# Altium schematic sheet MCU.SchDoc: MCU
size A4; Date: 2020/05/29; SheetNumber: 1
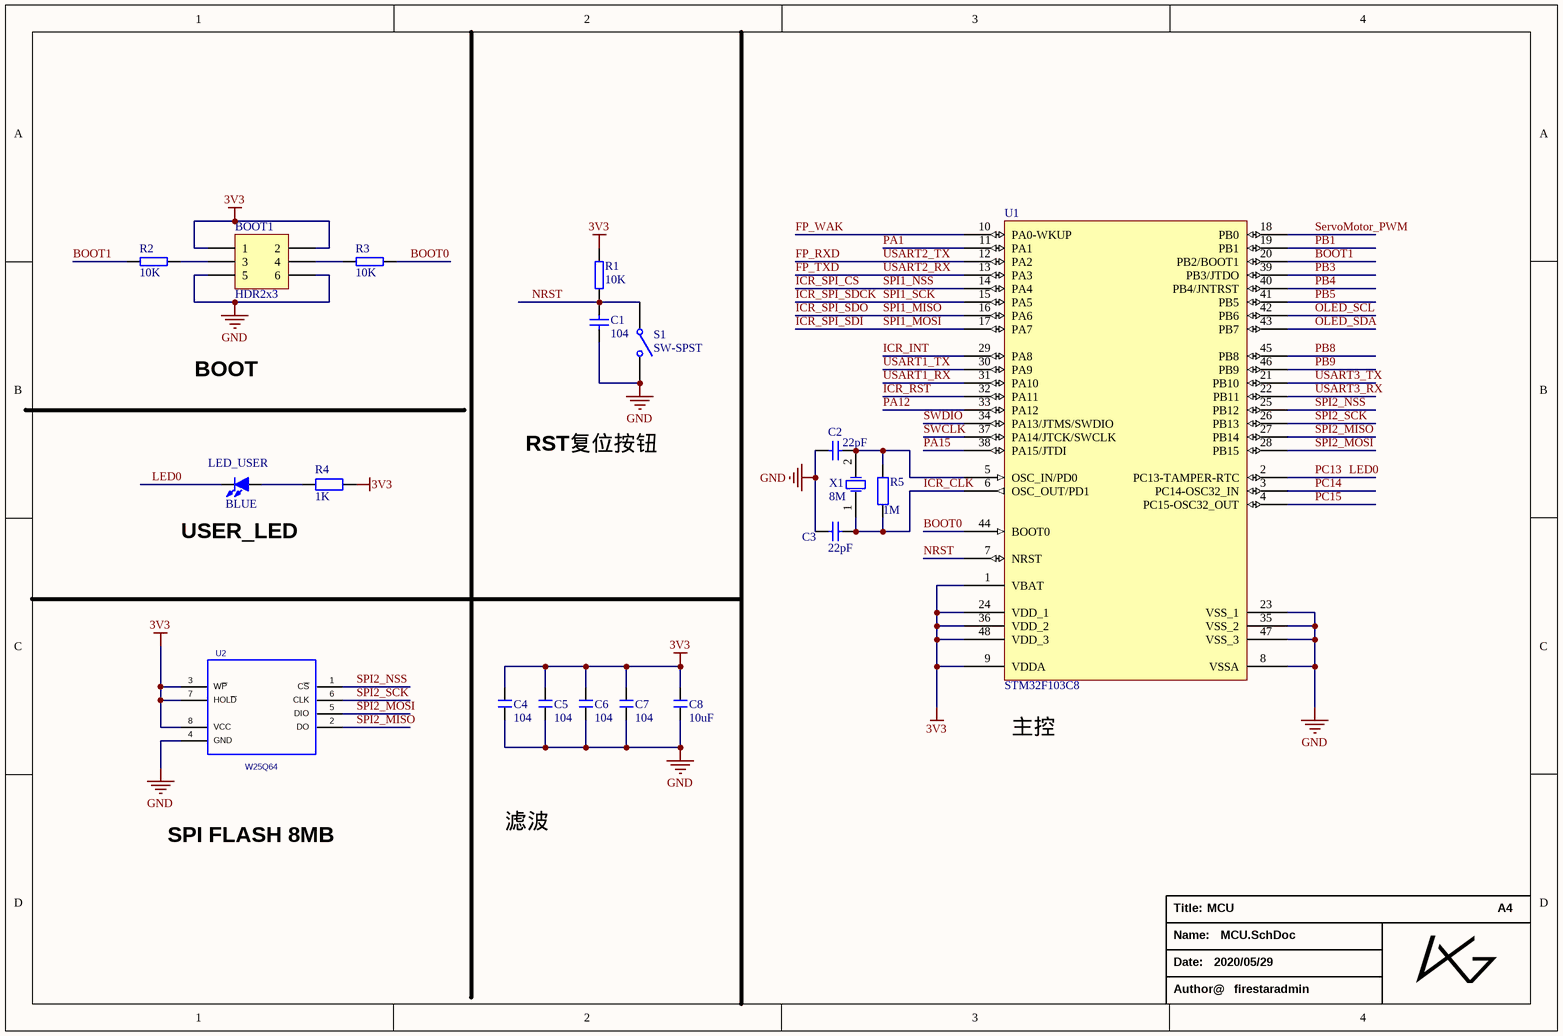
[diagram p0: MCU.SchDoc]

## Parts
BOOT1  HDR2x3  [HDR2.54-LI-2x3P]
C1  104  [C 0603_M]
C2  22pF  [C 0603_M]
C3  22pF  [C 0603_M]
C4  104  [C 0603_M]
C5  104  [C 0603_M]
C6  104  [C 0603_M]
C7  104  [C 0603_M]
C8  10uF  [C 0805_M]
LED_USER  BLUE  [LED 0603B]
R1  10K  [R 0603_M]
R2  10K  [R 0603_M]
R3  10K  [R 0603_M]
R4  1K  [R 0805_M]
R5  1M  [R 0603_M]
S1  SW-SPST  [TSW SMD-3*6*2.5]
U1  STM32F103C8  [LQFP48 7X7_M]
U2  W25Q64  [SOP8W_M]
X1  8M  [OSC 5032-2P]

## Nets
3V3: BOOT1.1 BOOT1.2 C4.2 C5.2 C6.2 C7.2 C8.2 R1.2 R4.2 U1.1(VBAT) U1.9(VDDA) U1.24(VDD_1) U1.36(VDD_2) U1.48(VDD_3) U2.3(W~{P}) U2.7(HOL~{D}) U2.8(VCC)
GND: BOOT1.5 BOOT1.6 C1.2 C2.2 C3.2 C4.1 C5.1 C6.1 C7.1 C8.1 S1.2(NO) U1.8(VSSA) U1.23(VSS_1) U1.35(VSS_2) U1.47(VSS_3) U2.4(GND)
BOOT0: R3.1 U1.44(BOOT0)
BOOT1: R2.2 U1.20(PB2/BOOT1)
FP_RXD: U1.12(PA2)  [also labelled USART2_TX]
FP_TXD: U1.13(PA3)  [also labelled USART2_RX]
FP_WAK: U1.10(PA0-WKUP)
ICR_CLK: C3.1 R5.1 U1.6(OSC_OUT/PD1) X1.1
ICR_INT: U1.29(PA8)
ICR_RST: U1.32(PA11)
ICR_SPI_CS: U1.14(PA4)  [also labelled SPI1_NSS]
ICR_SPI_SDCK: U1.15(PA5)  [also labelled SPI1_SCK]
ICR_SPI_SDI: U1.17(PA7)  [also labelled SPI1_MOSI]
ICR_SPI_SDO: U1.16(PA6)  [also labelled SPI1_MISO]
LED0: LED_USER.2(K) U1.2(PC13-TAMPER-RTC)  [also labelled PC13]
NRST: C1.1 R1.1 S1.1(COMMON) U1.7(NRST)
OLED_SCL: U1.42(PB6)
OLED_SDA: U1.43(PB7)
PA1: U1.11(PA1)
PA12: U1.33(PA12)
PA15: U1.38(PA15/JTDI)
PB1: U1.19(PB1)
PB3: U1.39(PB3/JTDO)
PB4: U1.40(PB4/JNTRST)
PB5: U1.41(PB5)
PB8: U1.45(PB8)
PB9: U1.46(PB9)
PC14: U1.3(PC14-OSC32_IN)
PC15: U1.4(PC15-OSC32_OUT)
ServoMotor_PWM: U1.18(PB0)
SPI2_MISO: U1.27(PB14) U2.2(DO)
SPI2_MOSI: U1.28(PB15) U2.5(DIO)
SPI2_NSS: U1.25(PB12) U2.1(C~{S})
SPI2_SCK: U1.26(PB13) U2.6(CLK)
SWCLK: U1.37(PA14/JTCK/SWCLK)
SWDIO: U1.34(PA13/JTMS/SWDIO)
USART1_RX: U1.31(PA10)
USART1_TX: U1.30(PA9)
USART3_RX: U1.22(PB11)
USART3_TX: U1.21(PB10)
NetBOOT1_3: BOOT1.3 R2.1
NetBOOT1_4: BOOT1.4 R3.2
NetC2_1: C2.1 R5.2 U1.5(OSC_IN/PD0) X1.2
NetLED_USER_1: LED_USER.1(A) R4.1

## Notes on the sheet
- BOOT
- RST复位按钮
- (near LED_USER) USER_LED
- (near U1) 主控
- SPI FLASH 8MB
- 滤波
- Title:
- A4
- Name:
- Date:
- Author@
- firestaradmin

## Library data of the parts
BOOT1 = HDR2x3: Connector
C1 = CAP1: Capacitor; Tolerate: 50V; Value: 100nF; TOL: 10%; ERP: 0103020075; PCB_Layout: Top Layer SMC; Revision: 2012-3-28; Publisher: ZL_A0OFFICE
C2 C3 = CAP1: Capacitor; Tolerate: 50V; Value: 20pF; TOL: 2%; ERP: 0103020090; PCB_Layout: Top Layer SMC; Revision: 2012-3-28; Publisher: ZL_A0OFFICE
C4-C8 = C: 无极性贴片电容; 版权归属: 源创客; BOM名称: 无极性贴片电容; 学习资源: www.ooocke.com
LED_USER = LED-SMD: 贴片LED; 版权归属: 源创客; BOM名称: 贴片LED; 学习资源: www.ooocke.com
R1-R3 = R
R4 R5 = R: 贴片电阻; 版权归属: 源创客; BOM名称: 贴片电阻; 学习资源: www.ooocke.com
S1 = SW-SPST: Single-Pole, Single-Throw Switch
U1 = STM32F103C8: Flaah:64/RAM:20/IO:36; BOM名称: 32位STM单片机; 版权归属: 源创客; 学习资源: www.ooocke.com
U2 = W25Q64: PCB DECAL: SO8WB
X1 = XTAL_SMD: Crystal Oscillator; ERP: 0103040021; Value: 8MHz; TOL: ±20ppm; Tolerate: ROSON -20_+70 20pf; PCB_Layout: Top Layer SMC; Publisher: ZL_A0OFFICE; Revision: 2012-3-28